# Altium schematic sheet led_driver.SchDoc: LED Driver Section
size A4; Author: Robocup; Organization: Hamburg Bit-Bots; Address1: Vogt-Kölln-Str. 30; Address2: 225257 Hamburg; Address3: Germany; Address4: www.bit-bots.de; DocumentNumber: 7; Revision: A; SheetNumber: 7; SheetTotal: 7; EMail: info@bit-bots.de
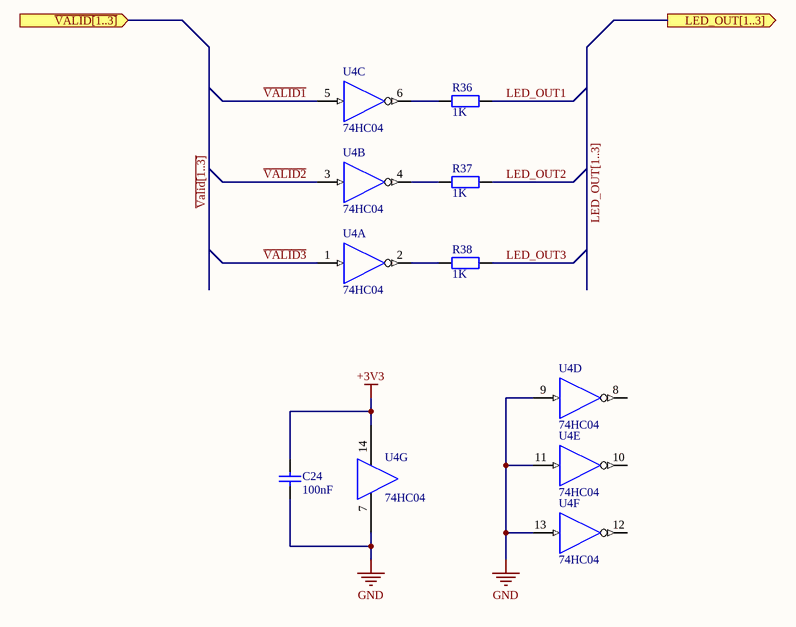
[diagram p0: led_driver.SchDoc]

## Parts
C24  100nF  [C2012]
R36  1K  [R2012]
R37  1K  [R2012]
R38  1K  [R2012]
U4  74HC04  [SOIC14]  (parts A,B,C,D,E,F,G of 7)

## Ports
LED_OUT[1..3] (out), ~{VALID[1..3]} (in)

## Nets
+3V3: C24.2 U4.14(VCC)
GND: C24.1 U4.7(GND) U4.9(A) U4.11(A) U4.13(A)
~{VALID1}: U4.5(A)
~{VALID2}: U4.3(A)
~{VALID3}: U4.1(A)
LED_OUT1: R36.2
LED_OUT2: R37.2
LED_OUT3: R38.2
NetR36_1: R36.1 U4.6(Y)
NetR37_1: R37.1 U4.4(Y)
NetR38_1: R38.1 U4.2(Y)

Not connected (* = marked no-connect by the designer): U4 8(Y) 10(Y) 12(Y)

## Buses and harness runs
bus LED_OUT[1..3] = port LED_OUT[1..3]
bus ~{Valid[1..3]} = port ~{VALID[1..3]}

## Notes on the sheet
- Project:
- Author:
- Title:
- Rev:
- Date:
- Time:
- Sheet
- of

## Library data of the parts
C24 = Cap: Capacitor; Published: 8-Jun-2000; LatestRevisionDate: 17-Jul-2002; LatestRevisionNote: Re-released for DXP Platform.; PackageReference: RAD-0.3; Publisher: Altium Limited; PackageDescription: Radial Cap, Thru-Hole; 2 Leads; 0.3 in Pin Spacing; Value: 100nF
R36-R38 = Res2: Resistor; Published: 8-Jun-2000; LatestRevisionDate: 17-Jul-2002; LatestRevisionNote: Re-released for DXP Platform.; PackageReference: AXIAL-0.4; Publisher: Altium Limited; PackageDescription: Axial Device, Thru-Hole; 2 Leads; 0.4 in Pin Spacing; Value: 1K
U4 = 74HC04: Hex Inverter; Supplier 1: Farnell; Supplier Part Number 1: 2445100